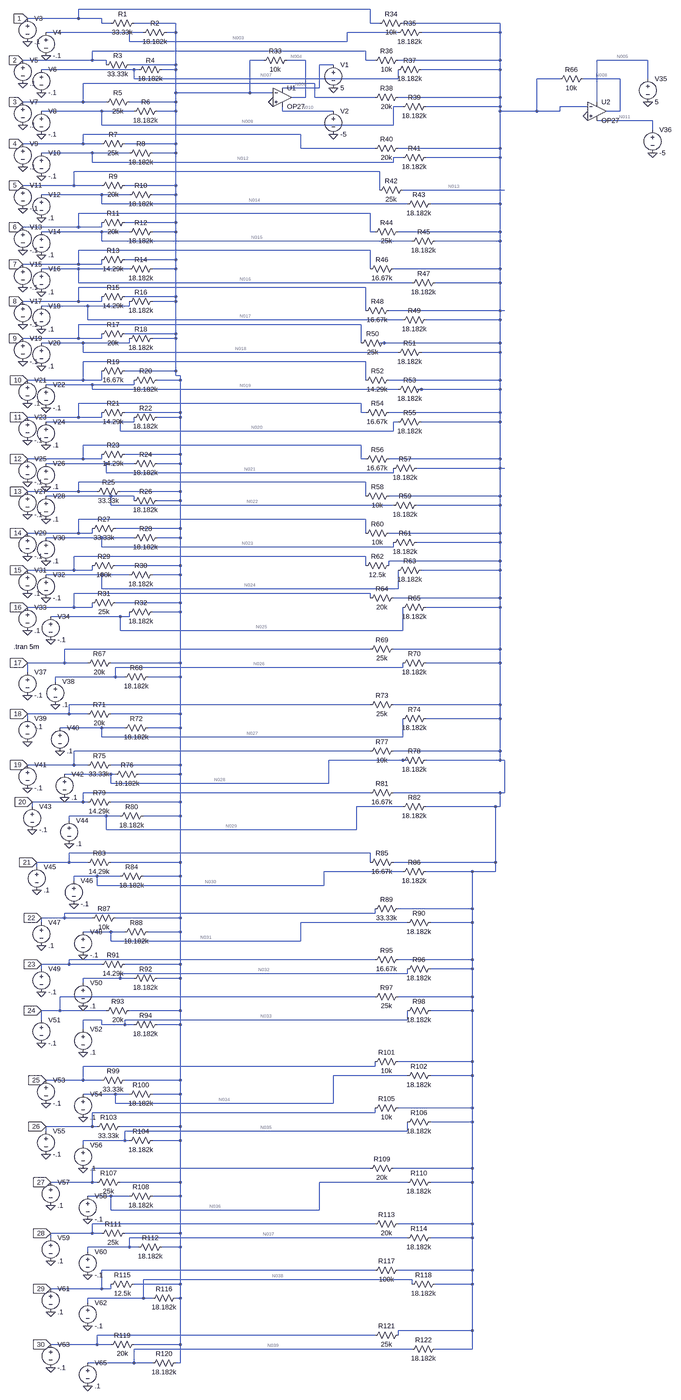
[diagram p0: schematic pattern_new_algo_error_check.asc, whole sheet]
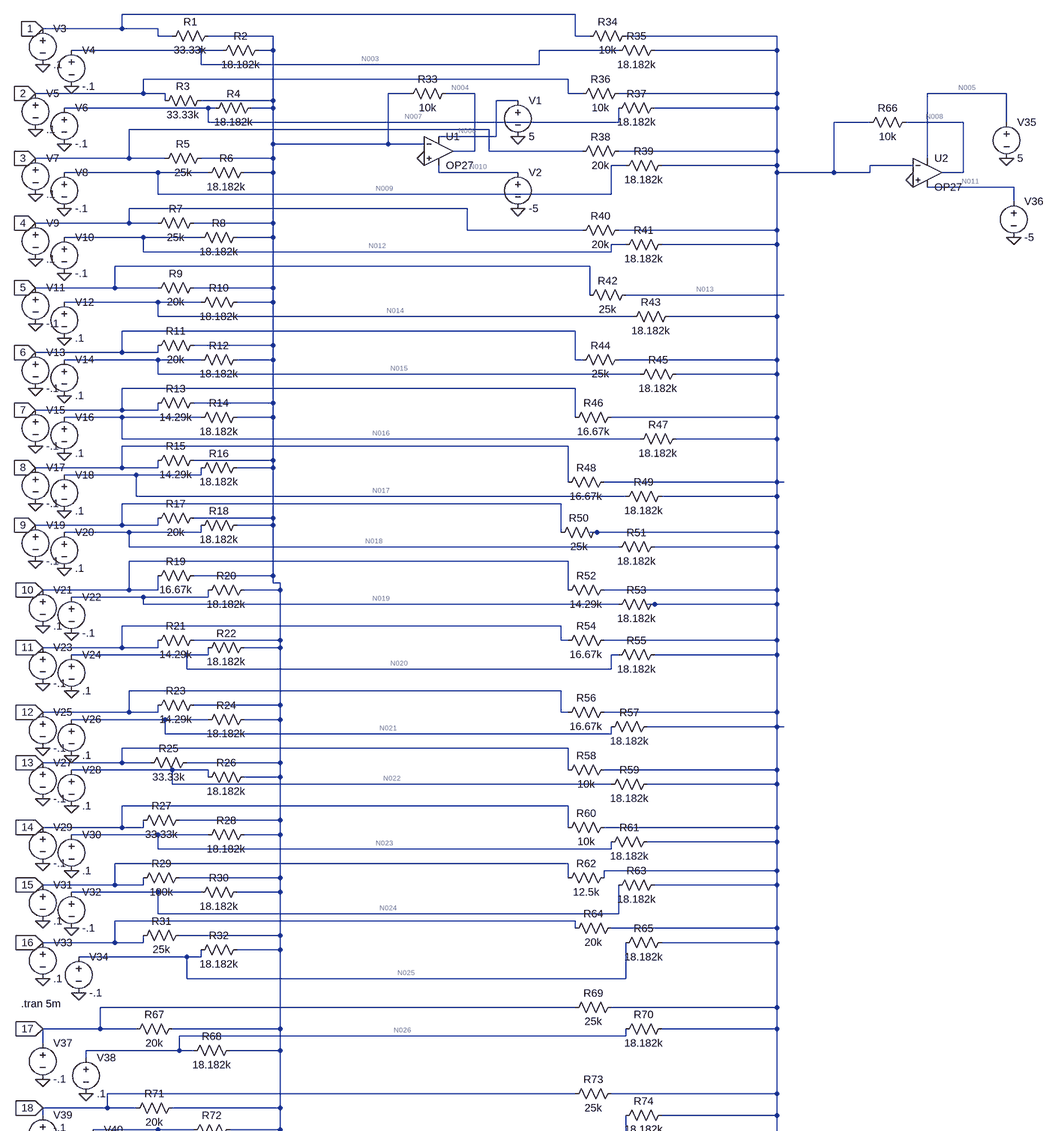
[diagram p1: schematic pattern_new_algo_error_check.asc, part, row 1 of 2, column 1 of 1]
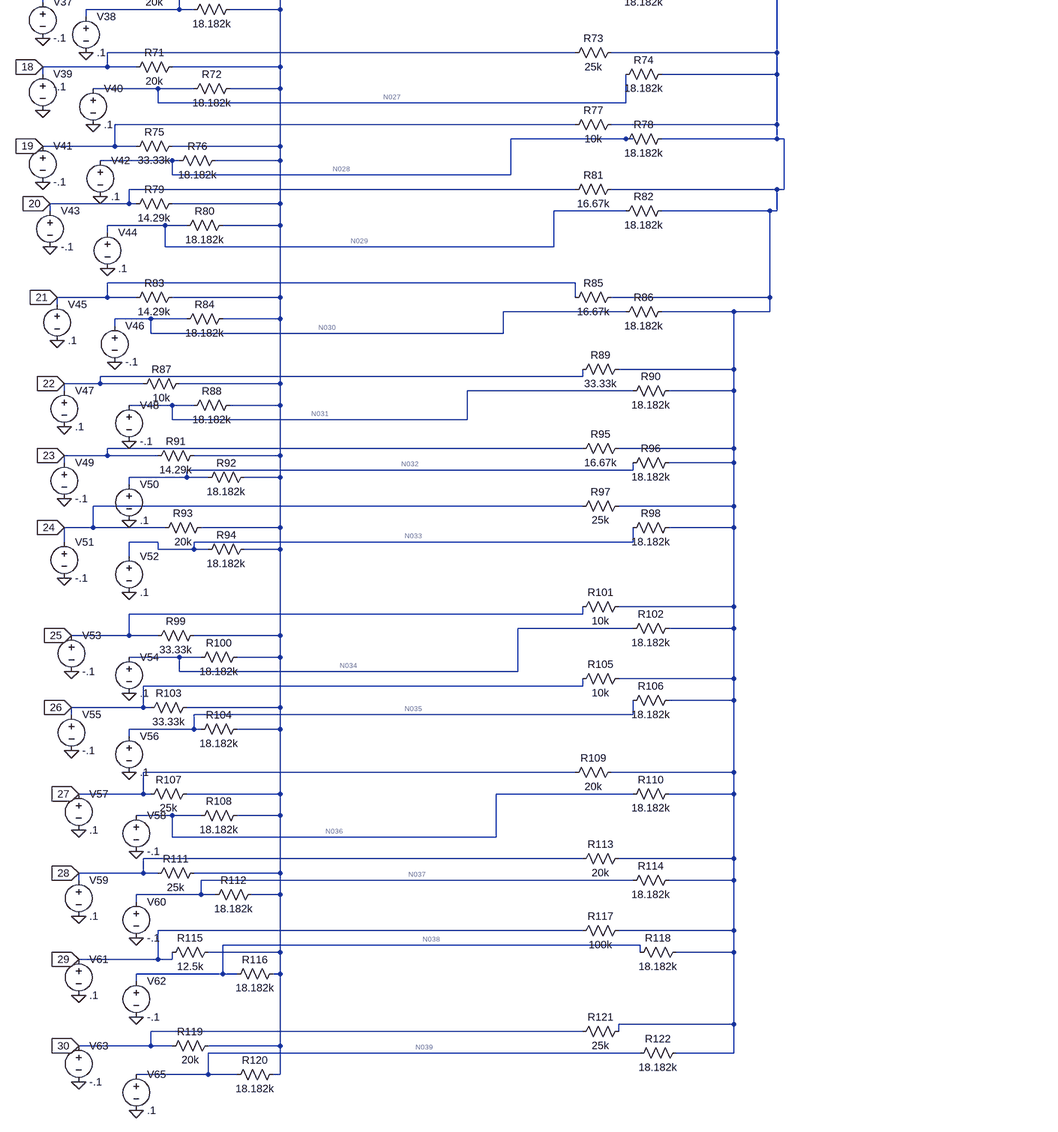
[diagram p2: schematic pattern_new_algo_error_check.asc, part, row 2 of 2, column 1 of 1]
* pattern_new_algo_error_check.asc
XU1 0 N001 N006 N010 N004 OP27  ; pins In+ In- V+ V- OUT
V1 N006 0 5
V2 N010 0 -5
V3 1 0 .1
V4 N003 0 -.1
V5 2 0 .1
V6 N007 0 -.1
V7 3 0 .1
V8 N009 0 -.1
V9 4 0 .1
V10 N012 0 -.1
V11 5 0 -.1
V12 N014 0 .1
V13 6 0 -.1
V14 N015 0 .1
V15 7 0 -.1
V16 N016 0 .1
V17 8 0 -.1
V18 N017 0 .1
V19 9 0 -.1
V20 N018 0 .1
V21 10 0 .1
V22 N019 0 -.1
V23 11 0 -.1
V24 N020 0 .1
V25 12 0 -.1
V26 N021 0 .1
V27 13 0 -.1
V28 N022 0 .1
V29 14 0 -.1
V30 N023 0 .1
V31 15 0 .1
V32 N024 0 -.1
V33 16 0 .1
V34 N025 0 -.1
R1 N001 1 33.33k
R2 N001 N003 18.182k
R3 N001 2 33.33k
R4 N001 N007 18.182k
R5 N001 3 25k
R6 N001 N009 18.182k
R7 N001 4 25k
R8 N001 N012 18.182k
R9 N001 5 20k
R10 N001 N014 18.182k
R11 N001 6 20k
R12 N001 N015 18.182k
R13 N001 7 14.29k
R14 N001 N016 18.182k
R15 N001 8 14.29k
R16 N001 N017 18.182k
R17 N001 9 20k
R18 N001 N018 18.182k
R19 N001 10 16.67k
R20 N001 N019 18.182k
R21 N001 11 14.29k
R22 N001 N020 18.182k
R23 N001 12 14.29k
R24 N001 N021 18.182k
R25 N001 13 33.33k
R26 N001 N022 18.182k
R27 N001 14 33.33k
R28 N001 N023 18.182k
R29 N001 15 100k
R30 N001 N024 18.182k
R31 N001 16 25k
R32 N001 N025 18.182k
R33 N004 N001 10k
R34 N002 1 10k
R35 N002 N003 18.182k
R36 N002 2 10k
R37 N002 N007 18.182k
R38 N002 3 20k
R39 N002 N009 18.182k
R40 N002 4 20k
R41 N002 N012 18.182k
R42 N013 5 25k
R43 N002 N014 18.182k
R44 N002 6 25k
R45 N002 N015 18.182k
R46 N002 7 16.67k
R47 N002 N016 18.182k
R48 N002 8 16.67k
R49 N002 N017 18.182k
R50 N002 9 25k
R51 N002 N018 18.182k
R52 N002 10 14.29k
R53 N002 N019 18.182k
R54 N002 11 16.67k
R55 N002 N020 18.182k
R56 N002 12 16.67k
R57 N002 N021 18.182k
R58 N002 13 10k
R59 N002 N022 18.182k
R60 N002 14 10k
R61 N002 N023 18.182k
R62 N002 15 12.5k
R63 N002 N024 18.182k
R64 N002 16 20k
R65 N002 N025 18.182k
XU2 0 N002 N005 N011 N008 OP27  ; pins In+ In- V+ V- OUT
V35 N005 0 5
V36 N011 0 -5
R66 N008 N002 10k
V37 17 0 -.1
V38 N026 0 .1
V39 18 0 -.1
V40 N027 0 .1
V41 19 0 -.1
V42 N028 0 .1
V43 20 0 -.1
V44 N029 0 .1
R67 N001 17 20k
R68 N001 N026 18.182k
R69 N002 17 25k
R70 N002 N026 18.182k
R71 N001 18 20k
R72 N001 N027 18.182k
R73 N002 18 25k
R74 N002 N027 18.182k
R75 N001 19 33.33k
R76 N001 N028 18.182k
R77 N002 19 10k
R78 N002 N028 18.182k
R79 N001 20 14.29k
R80 N001 N029 18.182k
R81 N002 20 16.67k
R82 N002 N029 18.182k
V45 21 0 .1
V46 N030 0 -.1
V47 22 0 .1
V48 N031 0 -.1
R83 N001 21 14.29k
R84 N001 N030 18.182k
R85 N002 21 16.67k
R86 N002 N030 18.182k
R87 N001 22 10k
R88 N001 N031 18.182k
R89 N002 22 33.33k
R90 N002 N031 18.182k
V49 23 0 -.1
V50 N032 0 .1
V51 24 0 -.1
V52 N033 0 .1
R91 N001 23 14.29k
R92 N001 N032 18.182k
R93 N001 24 20k
R94 N001 N033 18.182k
R95 N002 23 16.67k
R96 N002 N032 18.182k
R97 N002 24 25k
R98 N002 N033 18.182k
V53 25 0 -.1
V54 N034 0 .1
V55 26 0 -.1
V56 N035 0 .1
V57 27 0 .1
V58 N036 0 -.1
V59 28 0 .1
V60 N037 0 -.1
V61 29 0 .1
V62 N038 0 -.1
V63 30 0 -.1
R99 N001 25 33.33k
R100 N001 N034 18.182k
R101 N002 25 10k
R102 N002 N034 18.182k
R103 N001 26 33.33k
R104 N001 N035 18.182k
R105 N002 26 10k
R106 N002 N035 18.182k
R107 N001 27 25k
R108 N001 N036 18.182k
R109 N002 27 20k
R110 N002 N036 18.182k
R111 N001 28 25k
R112 N001 N037 18.182k
R113 N002 28 20k
R114 N002 N037 18.182k
R115 N001 29 12.5k
R116 N001 N038 18.182k
R117 N002 29 100k
R118 N002 N038 18.182k
R119 N001 30 20k
R120 N001 N039 18.182k
R121 N002 30 25k
R122 N002 N039 18.182k
V65 N039 0 .1
.tran 5m
.lib ADI.lib
.backanno
.end

* Results of the author's LTspice run, read from the files saved beside the schematic
* Operating Point, zero values left out:
*   V(n006) = 5 V
*   V(n004) = 9.919 mV
*   V(n010) = -5 V
*   V(1) = 100 mV
*   V(n003) = -100 mV
*   V(2) = 100 mV
*   V(n007) = -100 mV
*   V(3) = 100 mV
*   V(n009) = -100 mV
*   V(4) = 100 mV
*   V(n012) = -100 mV
*   V(5) = -100 mV
*   V(n014) = 100 mV
*   V(6) = -100 mV
*   V(n015) = 100 mV
*   V(7) = -100 mV
*   V(n016) = 100 mV
*   V(8) = -100 mV
*   V(n017) = 100 mV
*   V(9) = -100 mV
*   V(n018) = 100 mV
*   V(10) = 100 mV
*   V(n019) = -100 mV
*   V(11) = -100 mV
*   V(n020) = 100 mV
*   V(12) = -100 mV
*   V(n021) = 100 mV
*   V(13) = -100 mV
*   V(n022) = 100 mV
*   V(14) = -100 mV
*   V(n023) = 100 mV
*   V(15) = 100 mV
*   V(n024) = -100 mV
*   V(16) = 100 mV
*   V(n025) = -100 mV
*   V(n013) = -100 mV
*   V(n005) = 5 V
*   V(n008) = 69.96 mV
*   V(n011) = -5 V
*   V(17) = -100 mV
*   V(n026) = 100 mV
*   V(18) = -100 mV
*   V(n027) = 100 mV
*   V(19) = -100 mV
*   V(n028) = 100 mV
*   V(20) = -100 mV
*   V(n029) = 100 mV
*   V(21) = 100 mV
*   V(n030) = -100 mV
*   V(22) = 100 mV
*   V(n031) = -100 mV
*   V(23) = -100 mV
*   V(n032) = 100 mV
*   V(24) = -100 mV
*   V(n033) = 100 mV
*   V(25) = -100 mV
*   V(n034) = 100 mV
*   V(26) = -100 mV
*   V(n035) = 100 mV
*   V(27) = 100 mV
*   V(n036) = -100 mV
*   V(28) = 100 mV
*   V(n037) = -100 mV
*   V(29) = 100 mV
*   V(n038) = -100 mV
*   V(30) = -100 mV
*   V(n039) = 100 mV
*   I(R122) = -5.5 µA
*   I(R121) = 4 µA
*   I(R120) = -5.5 µA
*   I(R119) = 5 µA
*   I(R118) = 5.5 µA
*   I(R117) = -1 µA
*   I(R116) = 5.5 µA
*   I(R115) = -8 µA
*   I(R114) = 5.5 µA
*   I(R113) = -5 µA
*   I(R112) = 5.5 µA
*   I(R111) = -4 µA
*   I(R110) = 5.5 µA
*   I(R109) = -5 µA
*   I(R108) = 5.5 µA
*   I(R107) = -4 µA
*   I(R106) = -5.5 µA
*   I(R105) = 10 µA
*   I(R104) = -5.5 µA
*   I(R103) = 3 µA
*   I(R102) = -5.5 µA
*   I(R101) = 10 µA
*   I(R100) = -5.5 µA
*   I(R99) = 3 µA
*   I(R98) = -5.5 µA
*   I(R97) = 4 µA
*   I(R96) = -5.5 µA
*   I(R95) = 5.999 µA
*   I(R94) = -5.5 µA
*   I(R93) = 5 µA
*   I(R92) = -5.5 µA
*   I(R91) = 6.998 µA
*   I(R90) = 5.5 µA
*   I(R89) = -3 µA
*   I(R88) = 5.5 µA
*   I(R87) = -10 µA
*   I(R86) = 5.5 µA
*   I(R85) = -5.999 µA
*   I(R84) = 5.5 µA
*   I(R83) = -6.998 µA
*   I(R82) = -5.5 µA
*   I(R81) = 5.999 µA
*   I(R80) = -5.5 µA
*   I(R79) = 6.998 µA
*   I(R78) = -5.5 µA
*   I(R77) = 10 µA
*   I(R76) = -5.5 µA
*   I(R75) = 3 µA
*   I(R74) = -5.5 µA
*   I(R73) = 4 µA
*   I(R72) = -5.5 µA
*   I(R71) = 5 µA
*   I(R70) = -5.5 µA
*   I(R69) = 4 µA
*   I(R68) = -5.5 µA
*   I(R67) = 5 µA
*   I(R66) = 6.996 µA
*   I(R65) = 5.5 µA
*   I(R64) = -5 µA
*   I(R63) = 5.5 µA
*   I(R62) = -8 µA
*   I(R61) = -5.5 µA
*   I(R60) = 10 µA
*   I(R59) = -5.5 µA
*   I(R58) = 10 µA
*   I(R57) = -5.5 µA
*   I(R56) = 5.999 µA
*   I(R55) = -5.5 µA
*   I(R54) = 5.999 µA
*   I(R53) = 5.5 µA
*   I(R52) = -6.998 µA
*   I(R51) = -5.5 µA
*   I(R50) = 4 µA
*   I(R49) = -5.5 µA
*   I(R48) = 5.999 µA
*   I(R47) = -5.5 µA
*   I(R46) = 5.999 µA
*   I(R45) = -5.5 µA
*   I(R44) = 4 µA
*   I(R43) = -5.5 µA
*   I(R41) = 5.5 µA
*   I(R40) = -5 µA
*   I(R39) = 5.5 µA
*   I(R38) = -5 µA
*   I(R37) = 5.5 µA
*   I(R36) = -10 µA
*   I(R35) = 5.5 µA
*   I(R34) = -10 µA
*   I(R33) = 991.9 nA
*   I(R32) = 5.5 µA
*   I(R31) = -4 µA
*   I(R30) = 5.5 µA
*   I(R29) = -1 µA
*   I(R28) = -5.5 µA
*   I(R27) = 3 µA
*   I(R26) = -5.5 µA
*   I(R25) = 3 µA
*   I(R24) = -5.5 µA
*   I(R23) = 6.998 µA
*   I(R22) = -5.5 µA
*   I(R21) = 6.998 µA
*   I(R20) = 5.5 µA
*   I(R19) = -5.999 µA
*   I(R18) = -5.5 µA
*   I(R17) = 5 µA
*   I(R16) = -5.5 µA
*   I(R15) = 6.998 µA
*   I(R14) = -5.5 µA
*   I(R13) = 6.998 µA
*   I(R12) = -5.5 µA
*   I(R11) = 5 µA
*   I(R10) = -5.5 µA
*   I(R9) = 5 µA
*   I(R8) = 5.5 µA
*   I(R7) = -4 µA
*   I(R6) = 5.5 µA
*   I(R5) = -4 µA
*   I(R4) = 5.5 µA
*   I(R3) = -3 µA
*   I(R2) = 5.5 µA
*   I(R1) = -3 µA
*   I(V65) = -11 µA
*   I(V63) = 9 µA
*   I(V62) = 11 µA
*   I(V61) = -9 µA
*   I(V60) = 11 µA
*   I(V59) = -9 µA
*   I(V58) = 11 µA
*   I(V57) = -9 µA
*   I(V56) = -11 µA
*   I(V55) = 13 µA
*   I(V54) = -11 µA
*   I(V53) = 13 µA
*   I(V52) = -11 µA
*   I(V51) = 9 µA
*   I(V50) = -11 µA
*   I(V49) = 13 µA
*   I(V48) = 11 µA
*   I(V47) = -13 µA
*   I(V46) = 11 µA
*   I(V45) = -13 µA
*   I(V44) = -11 µA
*   I(V43) = 13 µA
*   I(V42) = -11 µA
*   I(V41) = 13 µA
*   I(V40) = -11 µA
*   I(V39) = 9 µA
*   I(V38) = -11 µA
*   I(V37) = 9 µA
*   I(V36) = 2.663 mA
*   I(V35) = -2.67 mA
*   I(V34) = 11 µA
*   I(V33) = -9 µA
*   I(V32) = 11 µA
*   I(V31) = -9 µA
*   I(V30) = -11 µA
*   I(V29) = 13 µA
*   I(V28) = -11 µA
*   I(V27) = 13 µA
*   I(V26) = -11 µA
*   I(V25) = 13 µA
*   I(V24) = -11 µA
*   I(V23) = 13 µA
*   I(V22) = 11 µA
*   I(V21) = -13 µA
*   I(V20) = -11 µA
*   I(V19) = 9 µA
*   I(V18) = -11 µA
*   I(V17) = 13 µA
*   I(V16) = -11 µA
*   I(V15) = 13 µA
*   I(V14) = -11 µA
*   I(V13) = 9 µA
*   I(V12) = -11 µA
*   I(V11) = 5 µA
*   I(V10) = 11 µA
*   I(V9) = -9 µA
*   I(V8) = 11 µA
*   I(V7) = -9 µA
*   I(V6) = 11 µA
*   I(V5) = -13 µA
*   I(V4) = 11 µA
*   I(V3) = -13 µA
*   I(V2) = 2.666 mA
*   I(V1) = -2.666 mA
*   Ix(u1:3) = 2.666 mA
*   Ix(u1:4) = -2.666 mA
*   Ix(u1:5) = -991.9 nA
*   Ix(u2:3) = 2.67 mA
*   Ix(u2:4) = -2.663 mA
*   Ix(u2:5) = -6.996 µA